# Altium schematic sheet analogheart_schem.SchDoc
size A; SheetNumber: 1; SheetTotal: 3
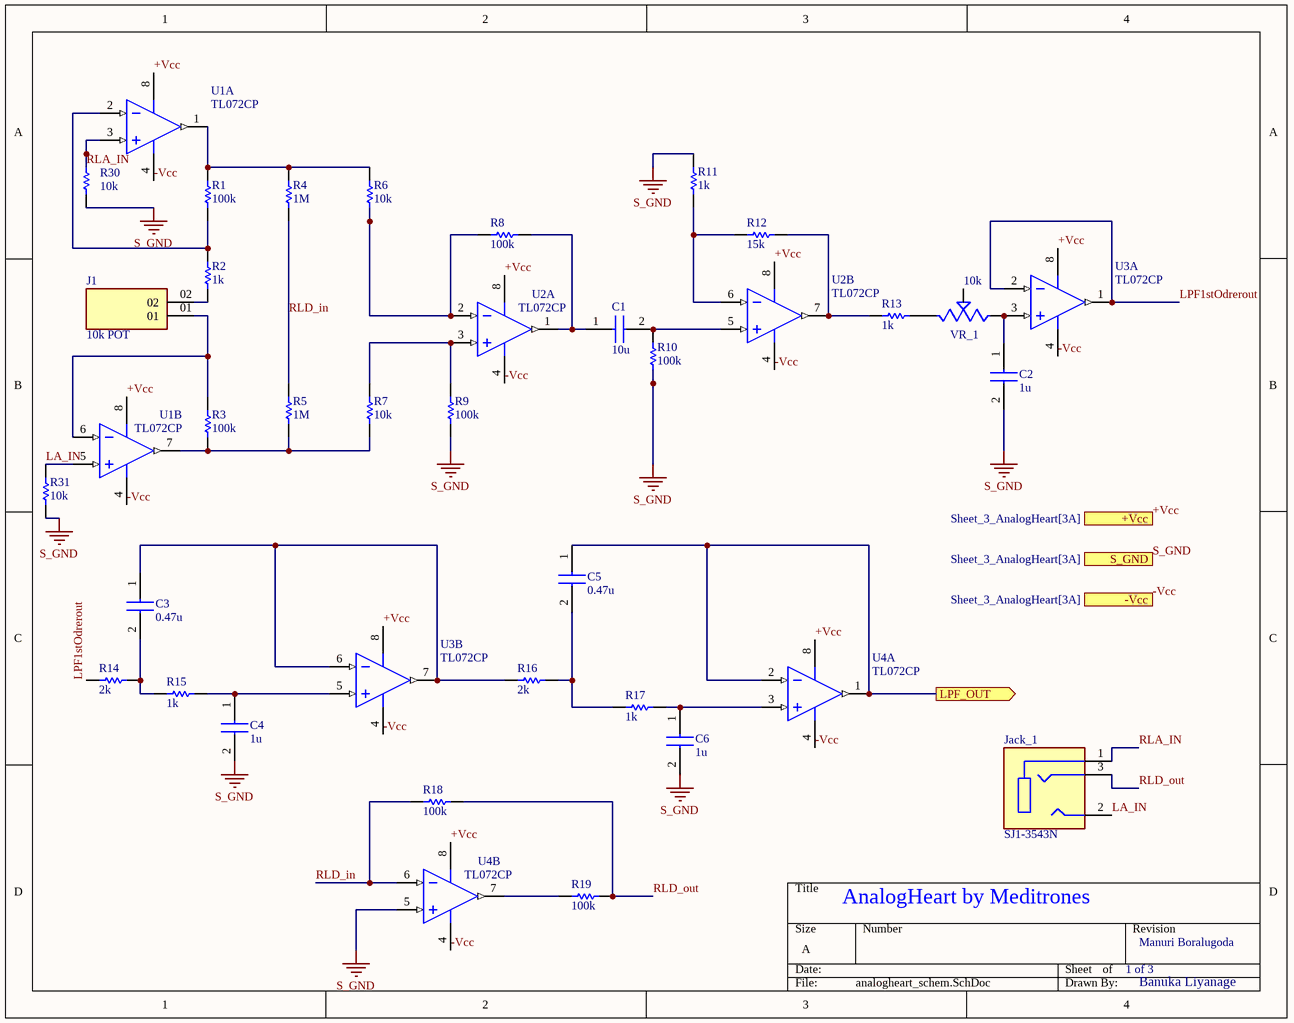
[diagram p0: analogheart_schem.SchDoc]

## Parts
C1  10u  [CAPC2012X94N]
C2  1u  [CAPC2012X94N]
C3  0.47u  [CAPC2012X94N]
C4  1u  [CAPC2012X94N]
C5  0.47u  [CAPC2012X94N]
C6  1u  [CAPC2012X94N]
J1  10k POT  [SAMTEC_MTSW-102-11-T-S-640]
Jack_1  SJ1-3543N  [CUI_SJ1-3543N]
R1  100k  [RESC2013X50X30NL20T20]
R2  1k  [RESC2013X50X30NL20T20]
R3  100k  [RESC2013X50X30NL20T20]
R4  1M  [RESC2013X50X30NL20T20]
R5  1M  [RESC2013X50X30NL20T20]
R6  10k  [RESC2013X50X30NL20T20]
R7  10k  [RESC2013X50X30NL20T20]
R8  100k  [RESC2013X50X30NL20T20]
R9  100k  [RESC2013X50X30NL20T20]
R10  100k  [RESC2013X50X30NL20T20]
R11  1k  [RESC2013X50X30NL20T20]
R12  15k  [RESC2013X50X30NL20T20]
R13  1k  [RESC2013X50X30NL20T20]
R14  2k  [RESC2013X50X30NL20T20]
R15  1k  [RESC2013X50X30NL20T20]
R16  2k  [RESC2013X50X30NL20T20]
R17  1k  [RESC2013X50X30NL20T20]
R18  100k  [RESC2013X50X30NL20T20]
R19  100k  [RESC2013X50X30NL20T20]
R30  10k  [RESC2013X50X30NL20T20]
R31  10k  [RESC2013X50X30NL20T20]
U1  TL072CP  [P0008A]  (parts A,B of 2)
U2  TL072CP  [P0008A]  (parts A,B of 2)
U3  TL072CP  [P0008A]  (parts A,B of 2)
U4  TL072CP  [P0008A]  (parts A,B of 2)
VR_1  10k  [TRIM_3386F-1-103TLF]

## Ports
+Vcc (in, see Sheet_3_AnalogHeart[3A]), -Vcc (in, see Sheet_3_AnalogHeart[3A]), LPF_OUT (out, see sheet_2_AnalogHeart[1C]), S_GND (in, see Sheet_3_AnalogHeart[3A])

## Nets
S_GND: C2.2 C4.2 C6.2 R9.1 R10.1 R11.2 R30.2 R31.2 U4.5(IN2+) ; port S_GND
+Vcc: U1.8(VCC+) U2.8(VCC+) U3.8(VCC+) U4.8(VCC+) ; port +Vcc
-Vcc: U1.4(VCC-) U2.4(VCC-) U3.4(VCC-) U4.4(VCC-) ; port -Vcc
LA_IN: Jack_1.2 R31.1 U1.5(IN2+)
LPF1stOdrerout: R14.2 U3.1(OUT1) U3.2(IN1-)
LPF_OUT: C5.1 U4.1(OUT1) U4.2(IN1-) ; port LPF_OUT
RLA_IN: Jack_1.1 R30.1 U1.3(IN1+)
RLD_in: R4.1 R5.2 R18.2 U4.6(IN2-)
RLD_out: Jack_1.3 R18.1 R19.1
NetC1_1: C1.1 R8.2 U2.1(OUT1)
NetC1_2: C1.2 R10.2 U2.5(IN2+)
NetC2_1: C2.1 U3.3(IN1+) VR_1.1(CCW)
NetC3_1: C3.1 R16.2 U3.6(IN2-) U3.7(OUT2)
NetC3_2: C3.2 R14.1 R15.2
NetC4_1: C4.1 R15.1 U3.5(IN2+)
NetC5_2: C5.2 R16.1 R17.2
NetC6_1: C6.1 R17.1 U4.3(IN1+)
NetJ1_01: J1.01 R3.2 U1.6(IN2-)
NetJ1_02: J1.02 R2.1
NetR1_1: R1.1 R2.2 U1.2(IN1-)
NetR1_2: R1.2 R4.2 R6.2 U1.1(OUT1)
NetR3_1: R3.1 R5.1 R7.1 U1.7(OUT2)
NetR6_1: R6.1 R8.1 U2.2(IN1-)
NetR7_2: R7.2 R9.2 U2.3(IN1+)
NetR11_1: R11.1 R12.2 U2.6(IN2-)
NetR12_1: R12.1 R13.2 U2.7(OUT2)
NetR13_1: R13.1 VR_1.3(CW)
NetR19_2: R19.2 U4.7(OUT2)

Not connected (* = marked no-connect by the designer): VR_1 2(WIPER)

## Notes on the sheet
- AnalogHeart by Meditrones
- 1 of 3
- Manuri Boralugoda
- Banuka Liyanage

## Library data of the parts
C1-C6 = 08055A331FAT2A: Capacitor; Manufacturer_Name: Kyocera AVX; Datasheet Link: https://componentsearchengine.com/Datasheets/1/06031A100FAT2A.pdf; Height: 0.94mm; Manufacturer_Part_Number: 08055A331FAT2A; Mouser Part Number: 581-08055A331FAT2A; Mouser Price/Stock: https://www.mouser.com/Search/Refine.aspx?Keyword=581-08055A331FAT2A; Arrow Part Number: 08055A331FAT2A; Arrow Price/Stock: https://www.arrow.com/en/products/08055a331fat2a/avx
J1 = MTSW-102-11-T-S-640: Package: None; Price: None; MP: MTSW-102-11-T-S-640; Availability: Unavailable; Value: *
Jack_1 = SJ1-3543N: MF: {'manufacturer': u'CUI'}; Package: None; Price: None; Value: *; MP: SJ1-3543N; Availability: Unavailable
R1-R19 R30 R31 = CMP-2001-04915-1: Manufacturer: Vishay Dale; Part Number: CRCW080510R0FKEA
U1-U4 = CMP-0017-00950-2: Dual Low-Noise JFET-Input General-Purpose Operational Amplifier, 7 to 36 V, 0 to 70 degC, 8-pin DIP (P8), Pb-Free (RoHS); Manufacturer: Texas Instruments; Sub Family: General Purpose Amplifier, High Supply Voltage Amplifier (>=30V); Total Supply Voltage(Max)(+5V is 5, +/-5V is 10): 36; Slew Rate(Typ)(V/us): 13; Vn at 1kHz(Typ)(nV/rtHz): 18; GBW(Typ)(MHz): 3; CMRR(Min)(dB): 70; Total Supply Voltage(Min)(+5V is 5, +/-5V is 10): 7; Vio (25C)(Max)(mV): 10; Rating: Catalog; IIB(Max)(pA): 200; Iq per channel(Max)(mA): 2.5; Number of Channels: 2; Mounting Technology: Through Hole; ComponentLink3Description: Package Specification; PartNumber: TL072CP; PackageVersion: 4040082/E, 04/2010; Eco-Plan: Pb-Free (RoHS); DatasheetVersion: SLOS080J; Offset Drift(Typ)(uV/C): 18; ComponentLink3URL: http://www.ti.com/litv/pdf/mpdi001b; PackageDescription: 8-Pin Plastic In-Line, Body 9.59 x 6.35 mm, Pitch 2.54 mm; Code_JEDEC: MS-001; ComponentLink2URL: http://www.ti.com/lit/ds/symlink/tl072.pdf; ComponentLink1Description: Manufacturer URL; ComponentLink2Description: Datasheet; ComponentLink1URL: http://www.ti.com/; PackageReference: P0008A
VR_1 = 3386F-1-103TLF: 10 kOhms 0.5W, 1/2W PC Pins Through Hole Trimmer Potentiometer Cermet 1.0 Turn Top Finger Adjustment; MF: Bourns; Package: 3386F-3 Bourns; Price: None; Check_prices: https://www.snapeda.com/parts/3386F-1-103TLF/Bourns/view-part/?ref=eda; Value: *; SnapEDA_Link: https://www.snapeda.com/parts/3386F-1-103TLF/Bourns/view-part/?ref=snap; MP: 3386F-1-103TLF; Availability: In Stock; Purchase-URL: https://pricing.snapeda.com/search/part/3386F-1-103TLF/?ref=eda